# EAGLE design lights3 (EAGLE 5.06)
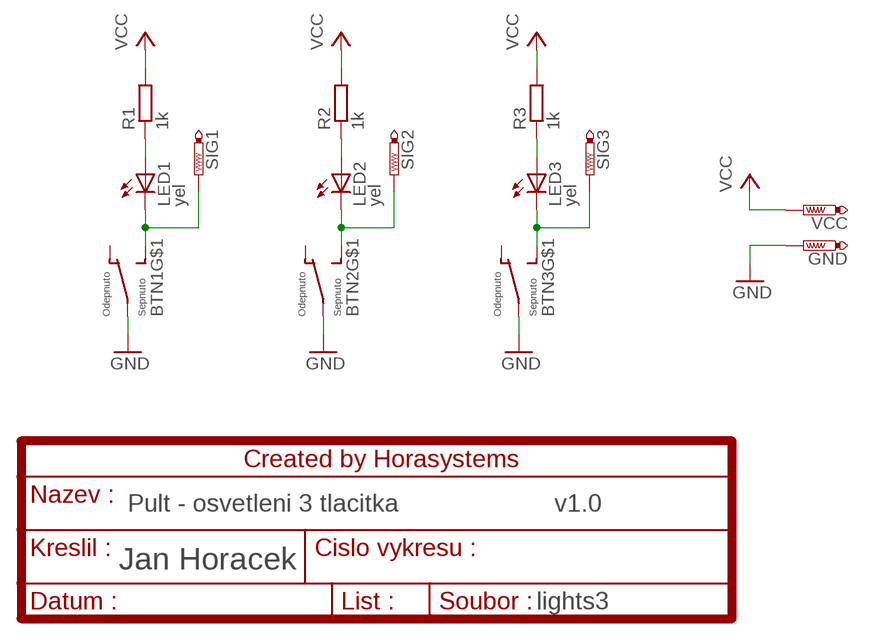
[diagram p0: schematic, sheet 1]

## Parts
BTN1  HORASPINAC  [HORASPINAC]
BTN2  HORASPINAC  [HORASPINAC]
BTN3  HORASPINAC  [HORASPINAC]
GND  PTR1PAD1-17Y  [P1-17Y]
LED1  yel  LED3MM  [LED3MM]
LED2  yel  LED3MM  [LED3MM]
LED3  yel  LED3MM  [LED3MM]
R1  1k  R-EU_R1206  [R1206]
R2  1k  R-EU_R1206  [R1206]
R3  1k  R-EU_R1206  [R1206]
SIG1  PTR1PAD1-17Y  [P1-17Y]
SIG2  PTR1PAD1-17Y  [P1-17Y]
SIG3  PTR1PAD1-17Y  [P1-17Y]
VCC  PTR1PAD1-17Y  [P1-17Y]

## Nets
GND: BTN1.NAPAJENI1(NAPAJENI) BTN2.NAPAJENI1(NAPAJENI) BTN3.NAPAJENI1(NAPAJENI) GND.1(TP)
N$1: LED1.A R1.1
N$2: BTN1.SEPNUTO1(SEPNUTO) LED1.K(C) SIG1.1(TP)
N$3: LED2.A R2.1
N$4: BTN2.SEPNUTO1(SEPNUTO) LED2.K(C) SIG2.1(TP)
N$5: LED3.A R3.1
N$6: BTN3.SEPNUTO1(SEPNUTO) LED3.K(C) SIG3.1(TP)
VCC: R1.2 R2.2 R3.2 VCC.1(TP)
Unconnected: BTN1.NAPAJENI2(NAPAJENI) BTN1.ODEPNUTO1(ODEPNUTO) BTN1.ODEPNUTO2(ODEPNUTO) BTN1.SEPNUTO2(SEPNUTO) BTN2.NAPAJENI2(NAPAJENI) BTN2.ODEPNUTO1(ODEPNUTO) BTN2.ODEPNUTO2(ODEPNUTO) BTN2.SEPNUTO2(SEPNUTO) BTN3.NAPAJENI2(NAPAJENI) BTN3.ODEPNUTO1(ODEPNUTO) BTN3.ODEPNUTO2(ODEPNUTO) BTN3.SEPNUTO2(SEPNUTO)

## Notes on the sheet
- Pult - osvetleni 3 tlacitka | v1.0

## Library data of the parts
BTN1-BTN3 = switch:HORASPINAC
GND SIG1-SIG3 VCC = testpad:PTR1: TEST PIN
LED1-LED3 = led:LED: LED OSRAM: - CHIPLED LG R971, LG N971, LY N971, LG Q971, LY Q971, LO R971, LY R971 LH N974, LH R974 LS Q976, LO Q976, LY Q976 LO Q996 - Hyper CHIPLED LW Q18S LB Q993, LB Q99A, LB R99A - SideLED LS A670, LO A670, LY A670, LG A670, LP A670 LB A673, LV A673, LT A673, LW A673 LH A674 LY A675 LS A676, LA A676, LO A676, LY A676, LW A676 LS A679, LY A679, LG A679 - Hyper Micro SIDELED® LS Y876, LA Y876, LO Y876, LY Y876 LT Y87S - SmartLED LW L88C, LW L88S LB L89C, LB L89S, LG L890 LS L89K, LO L89K, LY L89K LS L896, LA L896, LO L896, LY L896 - TOPLED LS T670, LO T670, LY T670, LG T670, LP T670 LSG T670, LSP T670, LSY T670, LOP T670, LYG T670 LG T671, LOG T671, LSG T671 LB T673, LV T673, LT T673, LW T673 LH T674 LS T676, LA T676, LO T676, LY T676, LB T676, LH T676, LSB T676, LW T676 LB T67C, LV T67C, LT T67C, LS T67K, LO T67K, LY T67K, LW E67C LS E67B, LA E67B, LO E67B, LY E67B, LB E67C, LV E67C, LT E67C LW T67C LS T679, LY T679, LG T679 LS T770, LO T770, LY T770, LG T770, LP T770 LB T773, LV T773, LT T773, LW T773 LH T774 LS E675, LA E675, LY E675, LS T675 LS T776, LA T776, LO T776, LY T776, LB T776 LHGB T686 LT T68C, LB T68C - Hyper Mini TOPLED® LB M676 - Mini TOPLED Santana® LG M470 LS M47K, LO M47K, LY M47K Source: http://www.osram.convergy.de LUXEON: - LUMILED® LXK2-PW12-R00, LXK2-PW12-S00, LXK2-PW14-U00, LXK2-PW14-V00 LXK2-PM12-R00, LXK2-PM12-S00, LXK2-PM14-U00 LXK2-PE12-Q00, LXK2-PE12-R00, LXK2-PE12-S00, LXK2-PE14-T00, LXK2-PE14-U00 LXK2-PB12-K00, LXK2-PB12-L00, LXK2-PB12-M00, LXK2-PB14-N00, LXK2-PB14-P00, LXK2-PB14-Q00 LXK2-PR12-L00, LXK2-PR12-M00, LXK2-PR14-Q00, LXK2-PR14-R00 LXK2-PD12-Q00, LXK2-PD12-R00, LXK2-PD12-S00 LXK2-PH12-R00, LXK2-PH12-S00 LXK2-PL12-P00, LXK2-PL12-Q00, LXK2-PL12-R00 Source: www.luxeon.com KINGBRIGHT: KA-3528ASYC Source: www.kingbright.com
R1-R3 = rcl:R-EU_: RESISTOR, European symbol

## Board
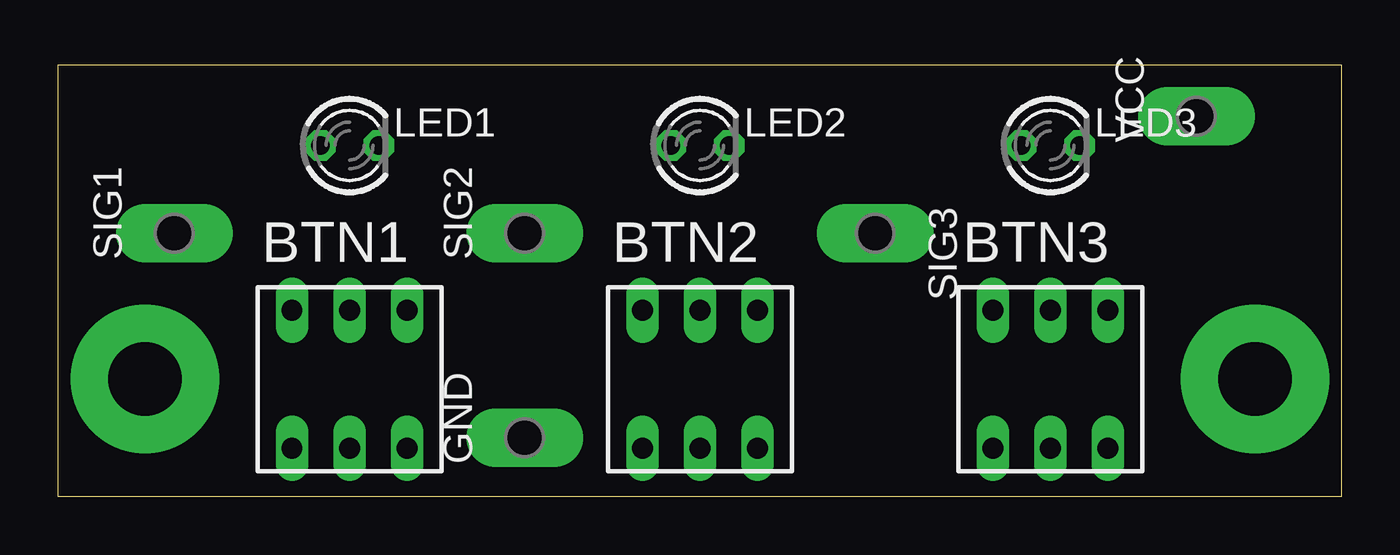
[diagram p1: board, top side]
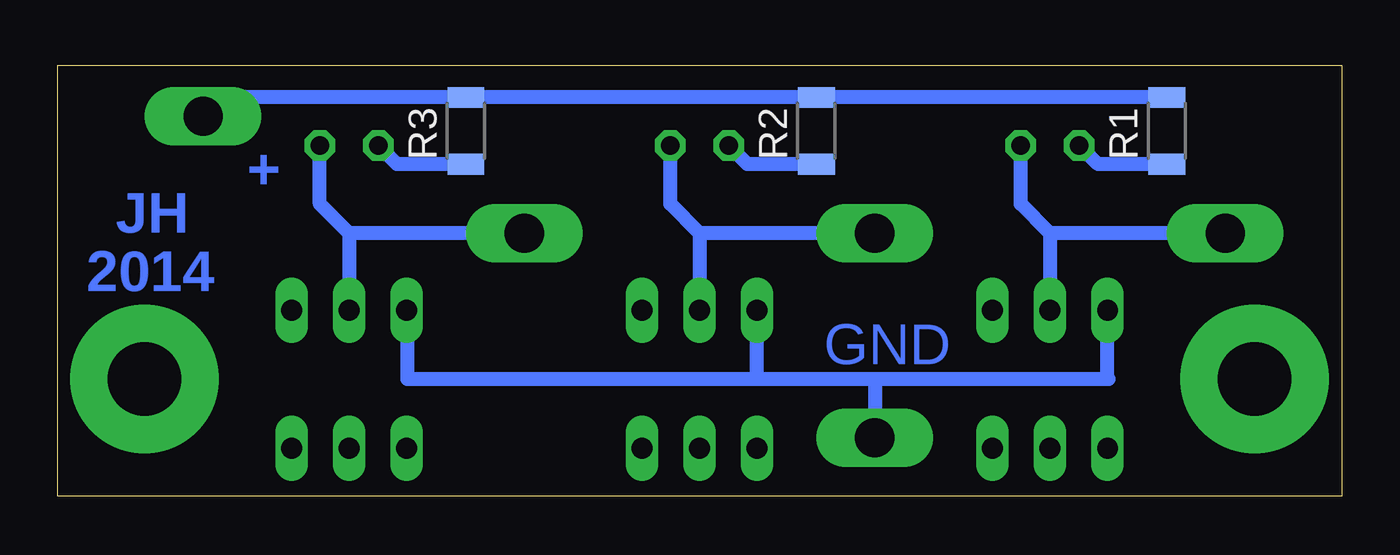
[diagram p2: board, bottom side, seen from below]

Size 55.86 x 18.72 mm. Coordinates in mm from the lower left corner, seen from the top.
Outline: 0,0 55.86,0 55.86,18.72 0,18.72 0,0
Copper layers (1*16): Top 0.035mm / dielectric 1.5mm / Bottom 0.035mm
Design rules "default": minimum track width 10mil, minimum drill 0.6mm, track to track 8mil, track to pad 8mil, pad to pad 8mil, via to via 8mil, smd to smd 8mil, copper to edge 40mil, drill to drill 8mil, minimum pad ring 10mil, minimum via ring 8mil, stop-mask expansion 4mil, vias tented up to drill 0mil, thermal gap 10mil

### Footprints (pad centres in the part's own frame; a part is rotated, then mirrored left to right if it is on the bottom)
HORASPINAC = drill 0.9 pad 1.422 long: NAPAJENI1 -2.5,3; NAPAJENI2 2.5,-3; ODEPNUTO1 2.5,3; ODEPNUTO2 -2.5,-3; SEPNUTO1 0,3; SEPNUTO2 0,-3
P1-17Y = drill 1.702 pad 2.121 long: 1 0,0
LED3MM = drill 0.813 octagon: A -1.27,0; K 1.27,0
R1206 = smd 0.9 x 1.6: 1 -1.45,0; 2 1.45,0

### Placement (x,y rotation side)
BTN1  12.7,5.08 0 top
BTN2  27.94,5.08 0 top
BTN3  43.18,5.08 0 top
GND  20.32,2.54 90 top
LED1  12.7,15.24 0 top
LED2  27.94,15.24 0 top
LED3  43.18,15.24 0 top
R1  7.62,15.88 90 bottom
R2  22.86,15.88 90 bottom
R3  38.1,15.88 90 bottom
SIG1  5.08,11.43 90 top
SIG2  20.32,11.43 90 top
SIG3  35.56,11.43 270 top
VCC  49.53,16.51 90 top

### Tracks (layer width: path | path; a pad name or v marks a point on that pad's centre or on a via)
GND
  Bottom 0.406: 10.16,5.08 10.2,5.12 | 40.64,8.04 BTN3.NAPAJENI1 | 25.4,5.08 25.44,5.12
  Bottom 0.61: 10.2,5.12 BTN1.NAPAJENI1 | 10.16,5.08 20.32,5.08 | 20.32,5.08 25.4,5.08 40.64,5.08 40.64,8.04 | 25.44,5.12 BTN2.NAPAJENI1 | 20.32,5.08 GND.1
N$1
  Bottom 0.61: R1.1 10.62,14.43 LED1.A
N$2
  Bottom 0.61: 12.7,11.43 BTN1.SEPNUTO1 | 12.7,11.43 13.97,12.7 LED1.K | SIG1.1 12.7,11.43
N$3
  Bottom 0.61: R2.1 25.86,14.43 LED2.A
N$4
  Bottom 0.61: 27.94,11.43 BTN2.SEPNUTO1 | 27.94,11.43 29.21,12.7 LED2.K | SIG2.1 27.94,11.43
N$5
  Bottom 0.61: R3.1 41.09,14.43 LED3.A
N$6
  Bottom 0.61: 43.18,11.43 BTN3.SEPNUTO1 | 43.18,11.43 44.45,12.7 LED3.K | SIG3.1 43.18,11.43
N$7  (via drill 3.2 pad 6.45)
  other vias: 52.07,5.08
N$8  (via drill 3.2 pad 6.45)
  other vias: 3.81,5.08
VCC
  Bottom 0.61: R1.2 R2.2 R3.2 48.72,17.32 VCC.1

### Text on the board
Bottom: + | JH | 2014 | GND